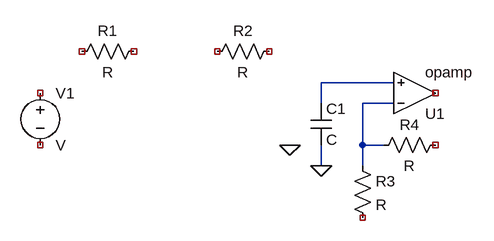
[diagram p0: schematic Draft2.asc]
Draft2.asc, the LTspice schematic file:
Version 4.1
SHEET 1 880 680
WIRE 528 144 416 144
WIRE 416 176 416 144
WIRE 528 176 480 176
WIRE 480 240 480 176
WIRE 512 240 480 240
WIRE 416 272 416 240
WIRE 480 272 480 240
FLAG 416 272 0
FLAG 368 240 0
SYMBOL voltage -16 144 R0
SYMATTR InstName V1
SYMBOL res 144 80 R90
WINDOW 0 0 56 VBottom 2
WINDOW 3 32 56 VTop 2
SYMATTR InstName R1
SYMBOL res 352 80 R90
WINDOW 0 0 56 VBottom 2
WINDOW 3 32 56 VTop 2
SYMATTR InstName R2
SYMBOL cap 400 176 R0
SYMATTR InstName C1
SYMBOL res 464 256 R0
SYMATTR InstName R3
SYMBOL res 608 224 R90
WINDOW 0 0 56 VBottom 2
WINDOW 3 32 56 VTop 2
SYMATTR InstName R4
SYMBOL OpAmps\\opamp 560 224 M180
SYMATTR InstName U1

The netlist it stands for:
* Draft2.asc
V1 NC_01 NC_02 V
R1 NC_03 NC_04 R
R2 NC_05 NC_06 R
C1 N001 0 C
R3 N002 NC_07 R
R4 NC_08 N002 R
X§U1 N002 N001 NC_09 opamp Aol=100K GBW=10Meg  ; pins invin noninvin out
.backanno
.end